# EAGLE design bleumaus-nrf51822-mk-1.0.1 (EAGLE 9.3.1)
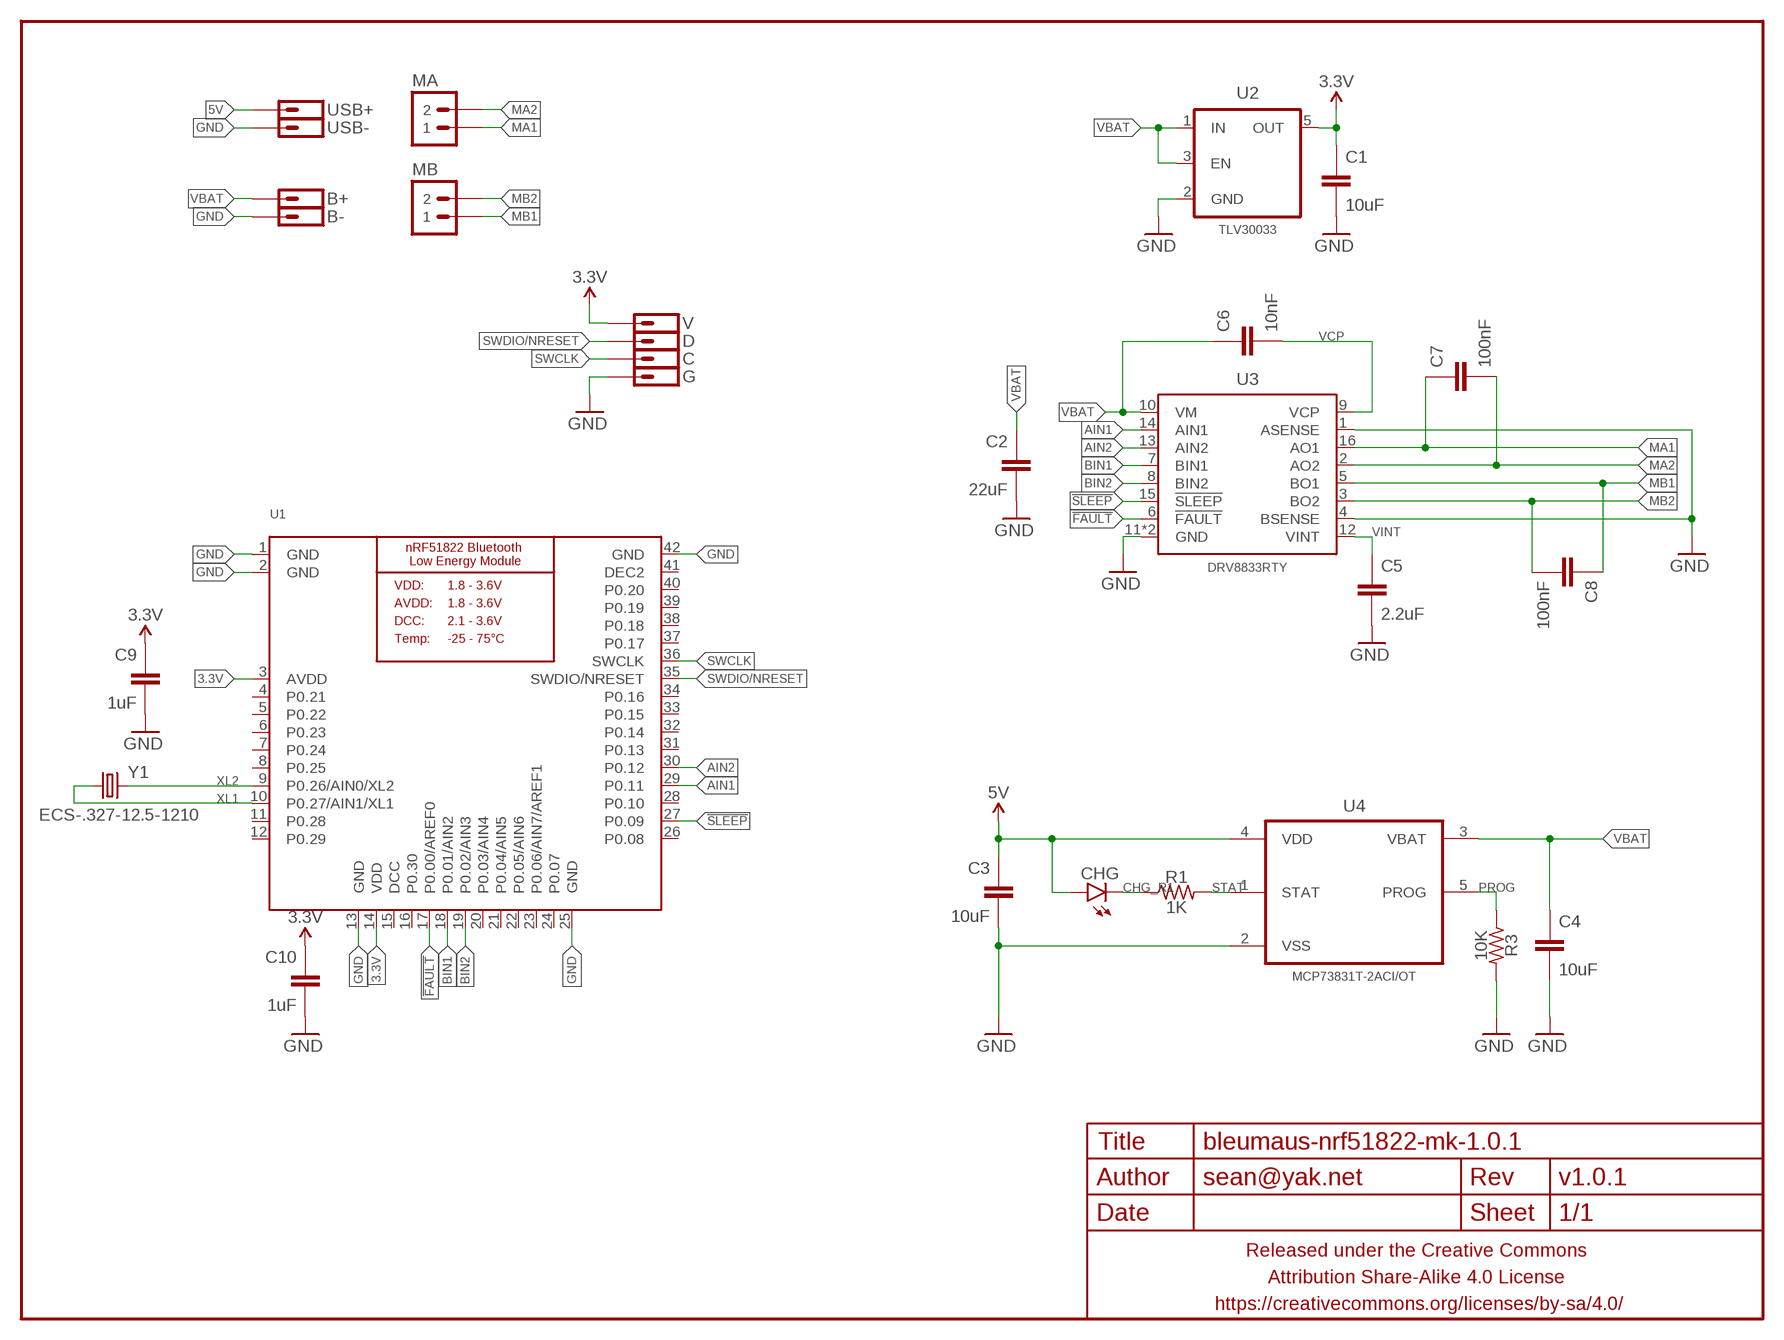
[diagram p0: schematic, sheet 1]

## Parts
B+  M01SMD-1DIA  [1X01-SMD-1MM-DIA]
B-  M01SMD-1DIA  [1X01-SMD-1MM-DIA]
C  M01SMD-1DIA  [1X01-SMD-1MM-DIA]
C1  10uF  CAPACITOR-CERAMICC0402  [C0402]
C2  22uF  CAPACITOR-CERAMICC1206  [C1206]
C3  10uF  CAPACITOR-CERAMICC0402  [C0402]
C4  10uF  CAPACITOR-CERAMICC0402  [C0402]
C5  2.2uF  CAPACITOR-CERAMICC0402  [C0402]
C6  10nF  CAPACITOR-CERAMICC0402  [C0402]
C7  100nF  CAPACITOR-CERAMICC0402  [C0402]
C8  100nF  CAPACITOR-CERAMICC0402  [C0402]
C9  1uF  CAPACITOR-CERAMICC0402  [C0402]
C10  1uF  CAPACITOR-CERAMICC0402  [C0402]
CHG  LED0603-TIGHT  [LED-0603-TIGHT]
D  M01SMD-1DIA  [1X01-SMD-1MM-DIA]
FRAME1  FRAME-LETTERNO_PACKAGE  [DUMMY]
G  M01SMD-1DIA  [1X01-SMD-1MM-DIA]
MA  M02PTH-2MM  [1X02-2MM-PTH]
MB  M02PTH-2MM  [1X02-2MM-PTH]
R1  1K  RESISTORR0402  [R0402]
R3  10K  RESISTORR0402  [R0402]
U1  NRF51822_MODULE_MDBT40  [BLE_MODULE_RAYTAC_MDBT40]
U2  TLV30033  V_REG_ENTLV700XXDCK-TIGHTER  [SC70-TIGHTER]
U3  DRV8833RTY  [PWQFN-16]
U4  MCP73831T-2ACI/OT  [SOT95P280X145-5N]
USB+  M01SMD-1DIA  [1X01-SMD-1MM-DIA]
USB-  M01SMD-1DIA  [1X01-SMD-1MM-DIA]
V  M01SMD-1DIA  [1X01-SMD-1MM-DIA]
Y1  ECS-.327-12.5-1210  CRYSTAL1X1.2MM  [CRYSTAL-1X1.2MM]

## Nets
3.3V: C1.1 C9.1 C10.1 U1.3(AVDD) U1.14(VDD) U2.5(OUT) V.P$1
5V: C3.1 CHG.A U4.4(VDD) USB+.P$1
!FAULT: U1.17(P0.00/AREF0) U3.6(!FAULT)
!SLEEP: U1.27(P0.09) U3.15(!SLEEP)
AIN1: U1.29(P0.11) U3.14(AIN1)
AIN2: U1.30(P0.12) U3.13(AIN2)
BIN1: U1.18(P0.01/AIN2) U3.7(BIN1)
BIN2: U1.19(P0.02/AIN3) U3.8(BIN2)
CHG_R1: CHG.C R1.1
GND: B-.P$1 C1.2 C2.2 C3.2 C4.2 C5.2 C9.2 C10.2 G.P$1 R3.2 U1.1(GND) U1.2(GND) U1.13(GND) U1.25(GND) U1.42(GND) U2.2(GND) U3.1(ASENSE) U3.4(BSENSE) U3.11(GND) U3.17(GND) U4.2(VSS) USB-.P$1
MA1: C7.1 MA.P$1 U3.16(AO1)
MA2: C7.2 MA.P$2 U3.2(AO2)
MB1: C8.1 MB.P$1 U3.5(BO1)
MB2: C8.2 MB.P$2 U3.3(BO2)
PROG: R3.1 U4.5(PROG)
STAT: R1.2 U4.1(STAT)
SWCLK: C.P$1 U1.36(SWCLK)
SWDIO/NRESET: D.P$1 U1.35(SWDIO/NRESET)
VBAT: B+.P$1 C2.1 C4.1 C6.1 U2.1(IN) U2.3(EN) U3.10(VM) U4.3(VBAT)
VCP: C6.2 U3.9(VCP)
VINT: C5.1 U3.12(VINT)
XL1: U1.10(P0.27/AIN1/XL1) Y1.1
XL2: U1.9(P0.26/AIN0/XL2) Y1.2
Unconnected: U1.4(P0.21) U1.5(P0.22) U1.6(P0.23) U1.7(P0.24) U1.8(P0.25) U1.11(P0.28) U1.12(P0.29) U1.16(P0.30) U1.20(P0.03/AIN4) U1.21(P0.04/AIN5) U1.22(P0.05/AIN6) U1.23(P0.06/AIN7/AREF1) U1.24(P0.07) U1.26(P0.08) U1.28(P0.10) U1.31(P0.13) U1.32(P0.14) U1.33(P0.15) U1.34(P0.16) U1.37(P0.17) U1.38(P0.18) U1.39(P0.19) U1.40(P0.20)

## Power pins joined to a net without a drawn wire
DCC: U1.15(DCC)
DEC2: U1.41(DEC2)

## Library data of the parts
B+ B- C D G USB+ USB- V = a_parts:M01: Header 1 Standard 1-pin 0.1" header. Use with straight break away headers (SKU : PRT-00116), right angle break away headers (PRT-00553), swiss pins (PRT-00743), machine pins (PRT-00117), and female headers (PRT-00115).
C1-C10 = a_parts:CAPACITOR-CERAMIC: CAPACITOR, European symbol
CHG = a_parts:LED: LEDs Standard schematic elements and footprints for 5mm, 3mm, 1206, and 0603 sized LEDs. 5mm - Spark Fun Electronics SKU : COM-00529 (and others)
FRAME1 = a_parts:FRAME-LETTER: Schematic Frame Standard 8.5x11 US Letter frame; DESIGNER: sean@yak.net; VERSION: v1.0.1
MA MB = a_parts:M02: Standard 2-pin 0.1" header. Use with - straight break away headers ( PRT-00116) - right angle break away headers (PRT-00553) - swiss pins (PRT-00743) - machine pins (PRT-00117) - female headers (PRT-00115) Molex polarized connector foot print use with: PRT-08233 with associated crimp pins and housings. 2.54_SCREWTERM for use with PRT-10571. 3.5mm Screw Terminal footprints for PRT-08084 5mm Screw Terminal footprints for use with PRT-08433
R1 R3 = a_parts:RESISTOR: RESISTOR, American symbol
U1 = a_parts:NRF51822_MODULE_MDBT40: nRF51822 Bluetooth Low Energy Module
U2 = a_parts:V_REG_EN
U3 = a_parts:DRV8833
U4 = a_parts:MCP73831T-2ACI/OT: Charge Management Controller; MPN: MCP73831T-2ACI/OT; OC_FARNELL: 1332158; OC_NEWARK: 56K7045; PACKAGE: SOT-5; SUPPLIER: Microchip
Y1 = a_parts:CRYSTAL: Various standard crystals. Proven footprints. Spark Fun Electronics SKU : COM-00534

## Board
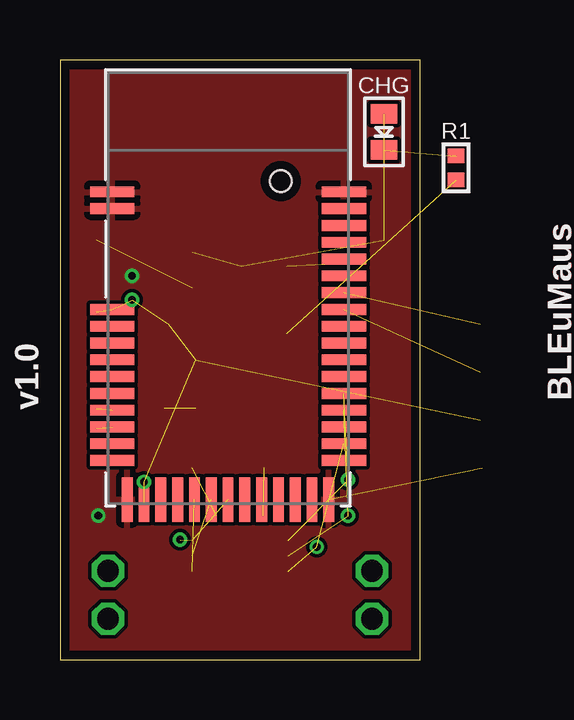
[diagram p1: board, top side]
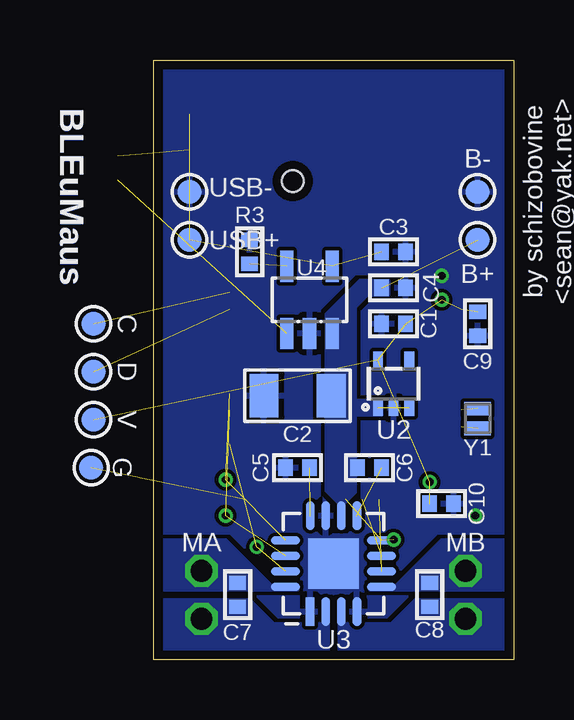
[diagram p2: board, bottom side, seen from below]

Size 15 x 25 mm. Coordinates in mm from the lower left corner, seen from the top.
Outline: 0,0 15,0 15,25 0,25 0,0
Copper layers (1*16): Top 0.035559375mm / dielectric 1.6mm / Bottom 0.035559375mm
Design rules "oshpark-2layer": minimum track width 6mil, minimum drill 10mil, track to track 6mil, track to pad 6mil, pad to pad 6mil, via to via 6mil, smd to smd 0mil, copper to edge 15mil, drill to drill 6mil, minimum pad ring 5mil, minimum via ring 5mil, stop-mask expansion 2.5mil, vias tented up to drill 20mil, thermal gap 10mil

### Footprints (pad centres in the part's own frame; a part is rotated, then mirrored left to right if it is on the bottom)
1X01-SMD-1MM-DIA = smd 1 x 1: P$1 0,0
C0402 = smd 0.6 x 0.7: 1 -0.5,0; 2 0.5,0
C1206 = smd 1.2 x 1.8: 1 -1.4,0; 2 1.4,0
LED-0603-TIGHT = smd 0.8 x 1.1: A 0.75,0; C -0.75,0
1X02-2MM-PTH = drill 0.9 octagon: P$1 -1,0; P$2 1,0
R0402 = smd 0.6 x 0.7: 1 -0.5,0; 2 0.5,0
BLE_MODULE_RAYTAC_MDBT40 = smd 1.85 x 0.45: 1 -4.825,4; 2 -4.825,3.3; 3 -4.825,-0.9; 4 -4.825,-1.6; 5 -4.825,-2.3; 6 -4.825,-3; 7 -4.825,-3.7; 8 -4.825,-4.4; 9 -4.825,-5.1; 10 -4.825,-5.8; 11 -4.825,-6.5; 12 -4.825,-7.2; 26 4.825,-7.2; 27 4.825,-6.5; 28 4.825,-5.8; 29 4.825,-5.1; 30 4.825,-4.4; 31 4.825,-3.7; 32 4.825,-3; 33 4.825,-2.3; 34 4.825,-1.6; 35 4.825,-0.9; 36 4.825,-0.2; 37 4.825,0.5; 38 4.825,1.2; 39 4.825,1.9; 40 4.825,2.6; 41 4.825,3.3; 42 4.825,4 | smd 0.45 x 1.85: 13 -4.2,-8.825; 14 -3.5,-8.825; 15 -2.8,-8.825; 16 -2.1,-8.825; 17 -1.4,-8.825; 18 -0.7,-8.825; 19 0,-8.825; 20 0.7,-8.825; 21 1.4,-8.825; 22 2.1,-8.825; 23 2.8,-8.825; 24 3.5,-8.825; 25 4.2,-8.825 | hole 0.9: 2.2,4.45
SC70-TIGHTER = smd 0.4 x 0.7: 1 -0.65,-1; 2 0,-1; 3 0.65,-1; 4 0.65,1; 5 -0.65,1
PWQFN-16 = smd 0.35 x 1.2: 1 -0.975,-2; 2 -0.325,-2; 3 0.325,-2; 4 0.975,-2; 9 0.975,2; 10 0.325,2; 11 -0.325,2; 12 -0.975,2 | smd 1.2 x 0.35: 5 2,-0.975; 6 2,-0.325; 7 2,0.325; 8 2,0.975; 13 -2,0.975; 14 -2,0.325; 15 -2,-0.325; 16 -2,-0.975 | smd 2.1 x 2.1: 17 0,0
SOT95P280X145-5N = smd 1.3 x 0.55: 1 -1.4,0.95; 2 -1.4,0; 3 -1.4,-0.95; 4 1.4,-0.95; 5 1.4,0.95
CRYSTAL-1X1.2MM = smd 0.575 x 1.1: 1 -0.412,0; 2 0.412,0

### Placement (x,y rotation side)
B+  1.5,17.5 90 bottom
B-  1.5,19.5 90 bottom
C  17.5,14 270 bottom
C1  5,14 180 bottom
C2  9,11 180 bottom
C3  5,17 0 bottom
C4  5,15.5 0 bottom
C5  9,8 180 bottom
C6  6,8 0 bottom
C7  11.5,2.7 270 bottom
C8  3.5,2.7 270 bottom
C9  1.5,14 270 bottom
C10  3,6.5 0 bottom
CHG  13.5,22 90 top
D  17.5,12 270 bottom
FRAME1  0,0 0 top
G  17.6,8 270 bottom
MA  13,2.7 270 bottom
MB  2,2.7 270 bottom
R1  16.5,20.5 270 top
R3  11,17 90 bottom
U1  7,15.5 0 top
U2  5,11.5 0 bottom
U3  7.5,4 0 bottom
U4  8.5,15 90 bottom
USB+  13.5,17.5 270 bottom
USB-  13.5,19.5 270 bottom
V  17.5,10 90 bottom
Y1  1.5,10.05 90 bottom

### Tracks (layer width: path | path; a pad name or v marks a point on that pad's centre or on a via)
3.3V  (via drill 0.33)  (8 unrouted)
  other vias: 3.5,7.4 3,15
5V  (3 unrouted)
!FAULT  (1 unrouted)
!SLEEP  (via drill 0.33)  (2 unrouted)
  other vias: 10.7,4.7
AIN1  (via drill 0.33)  (2 unrouted)
  other vias: 12,6
AIN2  (via drill 0.33)  (2 unrouted)
  other vias: 12,7.5
BIN1  (1 unrouted)
BIN2  (via drill 0.33)  (2 unrouted)
  other vias: 5,5
CHG_R1  (1 unrouted)
GND  (via drill 0.33)  (1 unrouted)
  other vias: 3,16 1.6,6
  pour Top (rank 6): 0,25 0,0 15,0 15,25
  pour Bottom (rank 6): 0,25 0,0 15,0 15,25
MA1
  pour Bottom (rank 5, no thermals): 15,2.9 9,2.9 9,3.1 10.1,3.1 12,5 15,5
MA2
  pour Bottom (rank 5, no thermals): 7.73,2.5 7.73,0 15,0 15,2.5 11,2.5 10,1.5 7.93,1.5 7.93,2.5
MB1
  pour Bottom (rank 5, no thermals): 0,2.9 6,2.9 6,3.1 4.9,3.1 3,5 0,5
MB2
  pour Bottom (rank 5, no thermals): 7.27,2.5 7.27,0 0,0 0,2.5 4.1,2.5 5.1,1.5 7.07,1.5 7.07,2.5
PROG  (1 unrouted)
STAT  (1 unrouted)
SWCLK  (1 unrouted)
SWDIO/NRESET  (1 unrouted)
VBAT  (2 unrouted)
  pour Bottom (no thermals): 7.8,7.03 7.8,14.4 6.4,15.8 5.2,15.8 5.2,15.2 6.1,15.2 6.6,14.7 6.6,10.8 5.5,10.8 5.5,10.2 6.6,10.2 6.6,6.97 7.07,6.5 7.07,5.5 7.27,5.5 7.27,6.5
VCP  (1 unrouted)
VINT  (1 unrouted)
XL1  (1 unrouted)
XL2  (1 unrouted)

### Text on the board
Top: BLEuMaus
Bottom: BLEuMaus
tPlace: BLEuMaus
bPlace: by schizobovine / <sean@yak.net> | BLEuMaus